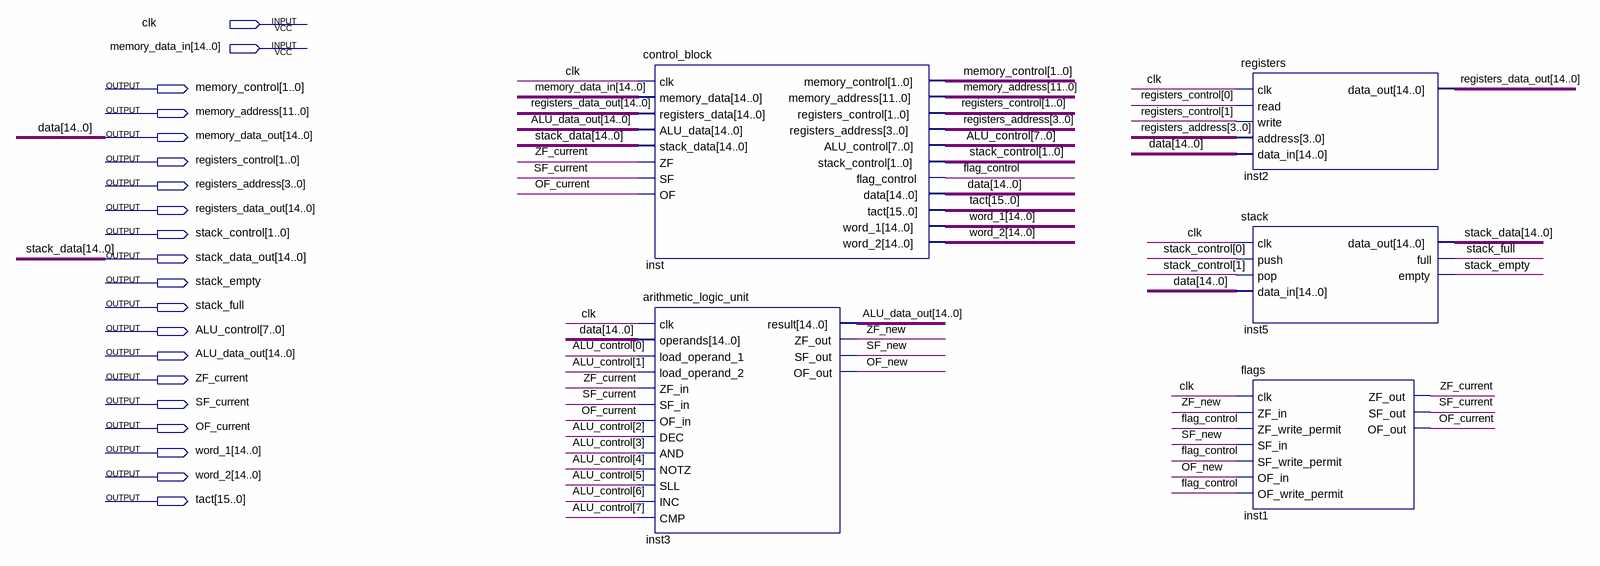
[diagram p0: schematic sheet]
// Quartus schematic cpu.bdf as structural Verilog: 5 symbols, 20 pins
module cpu (
  input  clk,
  input  [14:0] memory_data_in,
  output [1:0] memory_control,
  output [11:0] memory_address,
  output [14:0] memory_data_out,
  output [1:0] registers_control,
  output [3:0] registers_address,
  output [14:0] registers_data_out,
  output [1:0] stack_control,
  output [14:0] stack_data_out,
  output stack_empty,
  output stack_full,
  output [7:0] ALU_control,
  output [14:0] ALU_data_out,
  output ZF_current,
  output SF_current,
  output OF_current,
  output [14:0] word_1,
  output [14:0] word_2,
  output [15:0] tact
);

  wire flag_control, OF_new, SF_new, ZF_new;

  control_block inst (
    .clk(clk), .memory_data(memory_data_in), .registers_data(registers_data_out), .ALU_data(ALU_data_out),
    .stack_data(stack_data_out), .ZF(ZF_current), .SF(SF_current), .OF(OF_current),
    .memory_control(memory_control), .memory_address(memory_address), .registers_control(registers_control),
    .registers_address(registers_address), .ALU_control(ALU_control), .stack_control(stack_control),
    .flag_control(flag_control), .data(memory_data_out), .tact(tact), .word_1(word_1), .word_2(word_2));
  arithmetic_logic_unit inst3 (
    .clk(clk), .operands(memory_data_out), .load_operand_1(ALU_control[0]), .load_operand_2(ALU_control[1]),
    .ZF_in(ZF_current), .SF_in(SF_current), .OF_in(OF_current), .DEC(ALU_control[2]), .AND(ALU_control[3]),
    .NOTZ(ALU_control[4]), .SLL(ALU_control[5]), .INC(ALU_control[6]), .CMP(ALU_control[7]),
    .result(ALU_data_out), .ZF_out(ZF_new), .SF_out(SF_new), .OF_out(OF_new));
  registers inst2 (
    .clk(clk), .read(registers_control[0]), .write(registers_control[1]), .address(registers_address),
    .data_in(memory_data_out), .data_out(registers_data_out));
  stack inst5 (
    .clk(clk), .push(stack_control[0]), .pop(stack_control[1]), .data_in(memory_data_out),
    .data_out(stack_data_out), .full(stack_full), .empty(stack_empty));
  flags inst1 (
    .clk(clk), .ZF_in(ZF_new), .ZF_write_permit(flag_control), .SF_in(SF_new),
    .SF_write_permit(flag_control), .OF_in(OF_new), .OF_write_permit(flag_control), .ZF_out(ZF_current),
    .SF_out(SF_current), .OF_out(OF_current));

  // Other names for the same wires on the sheet: data[14:0] = memory_data_out; stack_data[14:0] = stack_data_out
endmodule
